# EAGLE design konekobit-001 (EAGLE 9.6.2)
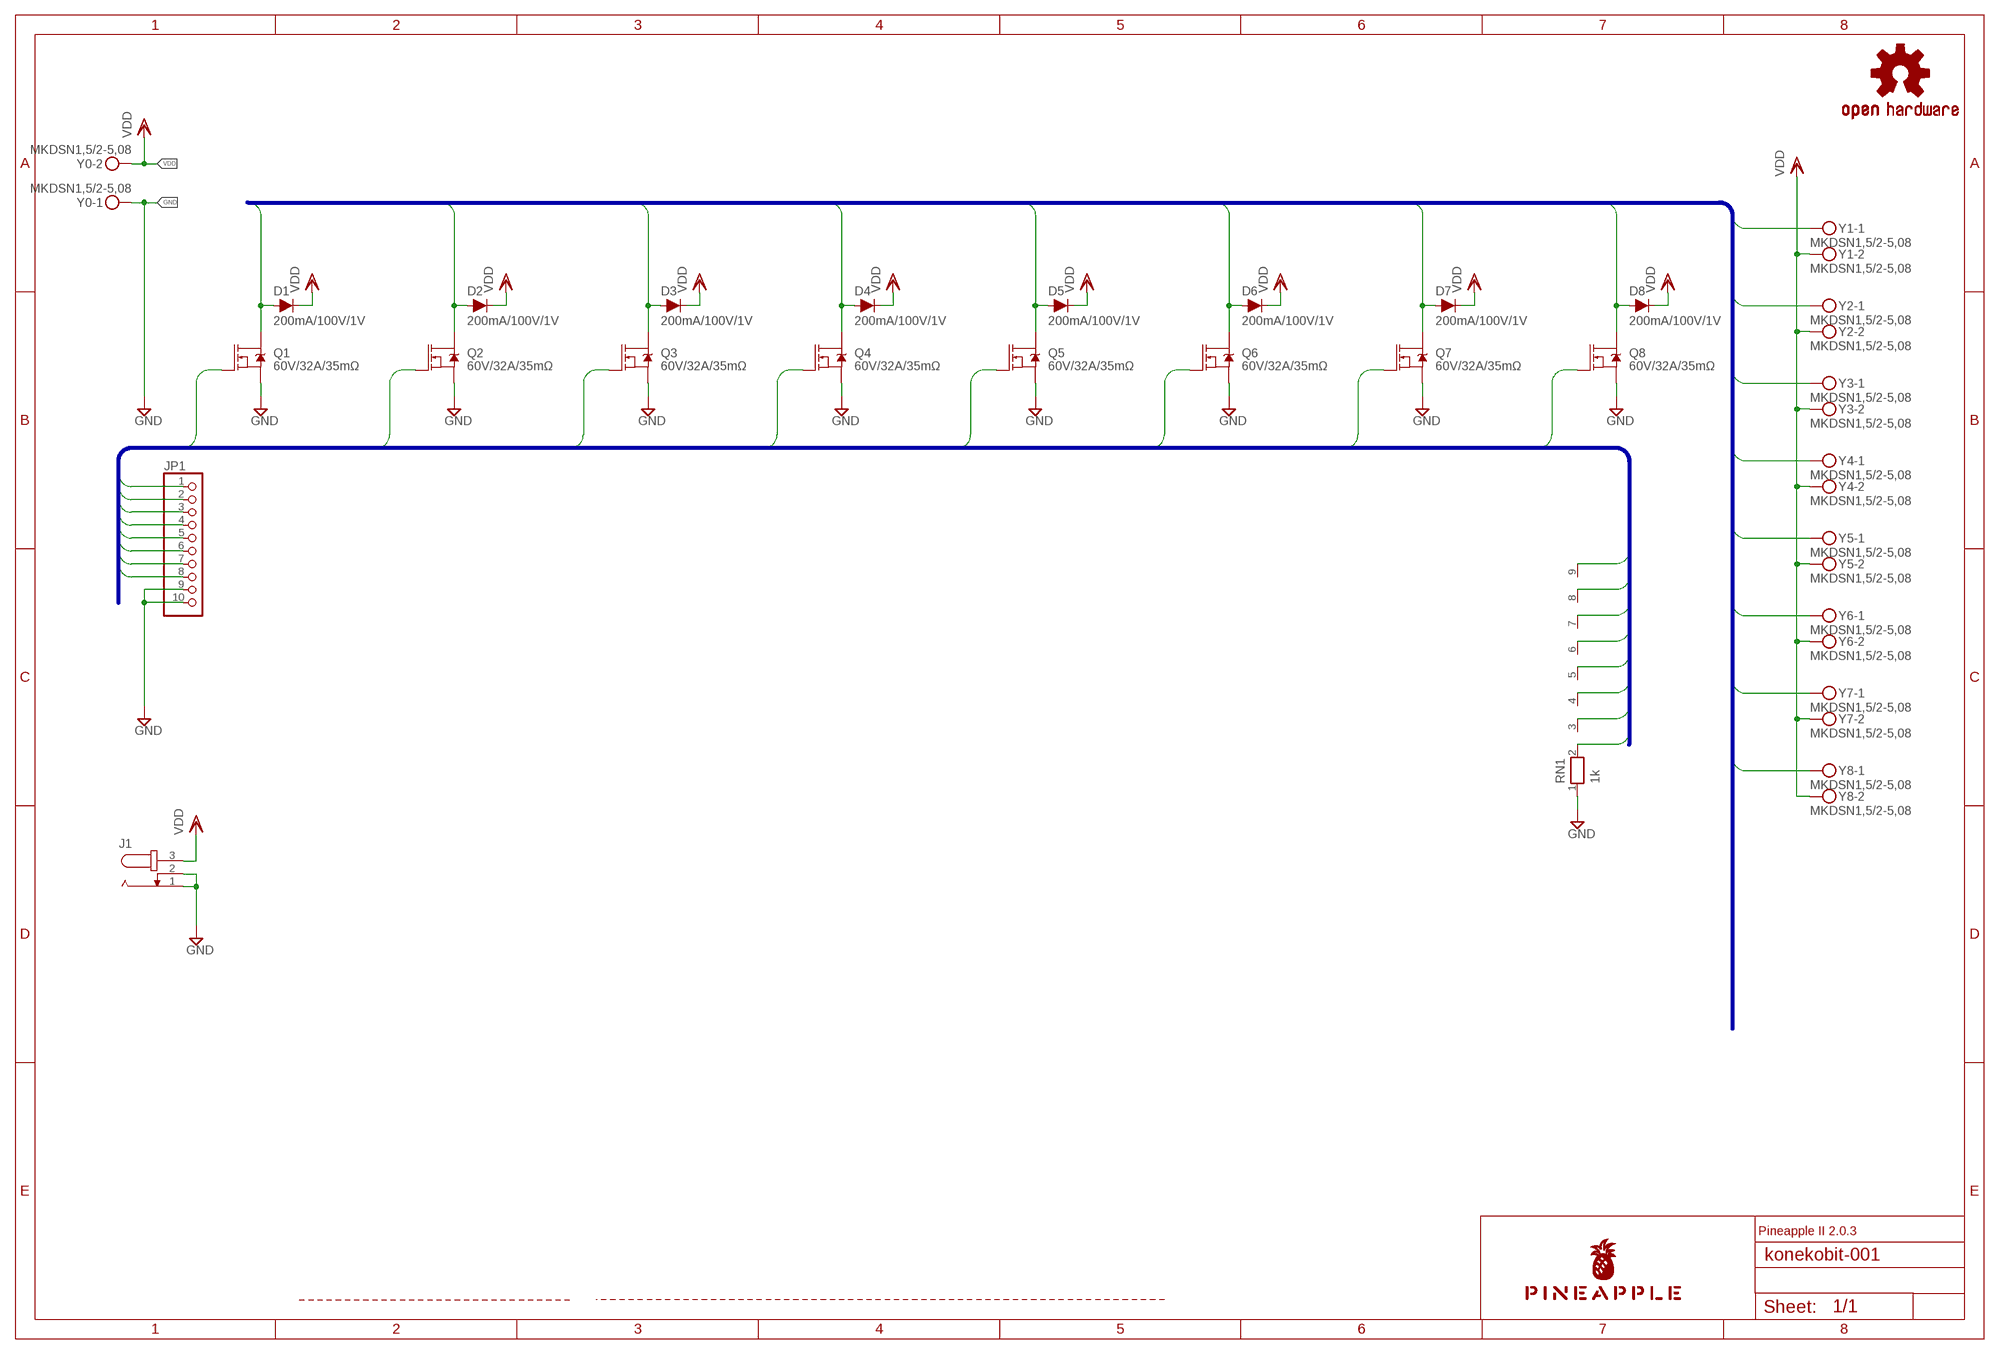
[diagram p0: schematic, sheet 1]

## Parts
D1  200mA/100V/1V  DIODE-1N4148  [DIODE-1N4148]
D2  200mA/100V/1V  DIODE-1N4148  [DIODE-1N4148]
D3  200mA/100V/1V  DIODE-1N4148  [DIODE-1N4148]
D4  200mA/100V/1V  DIODE-1N4148  [DIODE-1N4148]
D5  200mA/100V/1V  DIODE-1N4148  [DIODE-1N4148]
D6  200mA/100V/1V  DIODE-1N4148  [DIODE-1N4148]
D7  200mA/100V/1V  DIODE-1N4148  [DIODE-1N4148]
D8  200mA/100V/1V  DIODE-1N4148  [DIODE-1N4148]
J1  JACK-PLUG0  [SPC4077]
JP1  PINHD-1X10  [1X10]
LOGO1  OSHW-LOGOS-COPPER  [OSHW-LOGO-S_COPPER]
Q1  60V/32A/35mΩ  MOSFET-NCH-FQP30N06L  [TO220V]
Q2  60V/32A/35mΩ  MOSFET-NCH-FQP30N06L  [TO220V]
Q3  60V/32A/35mΩ  MOSFET-NCH-FQP30N06L  [TO220V]
Q4  60V/32A/35mΩ  MOSFET-NCH-FQP30N06L  [TO220V]
Q5  60V/32A/35mΩ  MOSFET-NCH-FQP30N06L  [TO220V]
Q6  60V/32A/35mΩ  MOSFET-NCH-FQP30N06L  [TO220V]
Q7  60V/32A/35mΩ  MOSFET-NCH-FQP30N06L  [TO220V]
Q8  60V/32A/35mΩ  MOSFET-NCH-FQP30N06L  [TO220V]
RN1  1k  RN08  [RN-9]
U$1  PINEAPPLE450_SILK  [PINEAPPLE450_SILK]
Y0  MKDSN1,5/2-5,08  [MKDSN1,5/2-5,08]
Y1  MKDSN1,5/2-5,08  [MKDSN1,5/2-5,08]
Y2  MKDSN1,5/2-5,08  [MKDSN1,5/2-5,08]
Y3  MKDSN1,5/2-5,08  [MKDSN1,5/2-5,08]
Y4  MKDSN1,5/2-5,08  [MKDSN1,5/2-5,08]
Y5  MKDSN1,5/2-5,08  [MKDSN1,5/2-5,08]
Y6  MKDSN1,5/2-5,08  [MKDSN1,5/2-5,08]
Y7  MKDSN1,5/2-5,08  [MKDSN1,5/2-5,08]
Y8  MKDSN1,5/2-5,08  [MKDSN1,5/2-5,08]

## Nets
DRAIN1 [power]: D1.A Q1.2(D) Y1.1
DRAIN2 [power]: D2.A Q2.2(D) Y2.1
DRAIN3 [power]: D3.A Q3.2(D) Y3.1
DRAIN4 [power]: D4.A Q4.2(D) Y4.1
DRAIN5 [power]: D5.A Q5.2(D) Y5.1
DRAIN6 [power]: D6.A Q6.2(D) Y6.1
DRAIN7 [power]: D7.A Q7.2(D) Y7.1
DRAIN8 [power]: D8.A Q8.2(D) Y8.1
GND [gnd]: J1.1 J1.2 JP1.9 JP1.10 Q1.3(S) Q2.3(S) Q3.3(S) Q4.3(S) Q5.3(S) Q6.3(S) Q7.3(S) Q8.3(S) RN1.1 Y0.1
PWM1: JP1.1 Q1.1(G) RN1.2
PWM2: JP1.2 Q2.1(G) RN1.3
PWM3: JP1.3 Q3.1(G) RN1.4
PWM4: JP1.4 Q4.1(G) RN1.5
PWM5: JP1.5 Q5.1(G) RN1.6
PWM6: JP1.6 Q6.1(G) RN1.7
PWM7: JP1.7 Q7.1(G) RN1.8
PWM8: JP1.8 Q8.1(G) RN1.9
VDD [superpower]: D1.C D2.C D3.C D4.C D5.C D6.C D7.C D8.C J1.3 Y0.2 Y1.2 Y2.2 Y3.2 Y4.2 Y5.2 Y6.2 Y7.2 Y8.2

## Buses
DRAIN1,DRAIN2,DRAIN3,DRAIN4,DRAIN5,DRAIN6,DRAIN7,DRAIN8
PWM1,PWM2,PWM3,PWM4,PWM5,PWM6,PWM7,PWM8

## Notes on the sheet
- Pineapple II 2.0.3

## Library data of the parts
D1-D8 = SparkFun-DiscreteSemi:DIODE: Diode These are standard reverse protection diodes and small signal diodes. SparkFun Products: SparkFun SparkPunk Sound Kit <https://www.sparkfun.com/products/11177> SparkFun ESP8266 Thing <https://www.sparkfun.com/products/13231>; PROD_ID: DIO-08378
J1 = con-jack:JACK-PLUG: DC POWER JACK Power Jack, DC, Right Angle, Through Hole, Rated 5A at 16VDC, PC Terminals Distributor: Farnell (www.Farnell.de) Drawing: 84N1161.pdf / 84N1162.pdf Manufacturer: SPC Technology (www.spctechnology.com) Type: SPC4077 / SPC 4078; OC_FARNELL: unknown; OC_NEWARK: unknown
JP1 = pinhead:PINHD-1X10: PIN HEADER
LOGO1 = SparkFun-Aesthetics:OSHW-LOGO: Open-Source Hardware (OSHW) Logo This logo indicates the piece of hardware it is found on incorporates a OSHW license and/or adheres to the definition of open source hardware found here: http://freedomdefined.org/OSHW
Q1-Q8 = SparkFun-DiscreteSemi:MOSFET-NCH: N-channel MOSFETs Voltage controlled devices that allow control of high current outputs. SparkFun Products: SparkFun OpenScale <https://www.sparkfun.com/products/13261> SparkFun Digital Sandbox <https://www.sparkfun.com/products/12651> SparkFun Monster Moto Shield <https://www.sparkfun.com/products/10182> SparkFun MOSFET Power Controller <https://www.sparkfun.com/products/11214>; PROD_ID: TRANS-10060
RN1 = resistor-net:RN08: RESISTOR NETWORK; OC_FARNELL: unknown; OC_NEWARK: unknown
U$1 = pineapple:PINEAPPLE450_SILK
Y0 Y1-Y8 = con-phoenix-508:MKDSN1,5/2-5,08: MKDSN 1,5/ 2-5,08 Printklemme Nennstrom: 13,5 A Nennspannung: 250 V Rastermaß: 5,08 mm Polzahl: 2 Anschlussart: Schraubanschluss Montage: Löten Anschlussrichtung Leiter/Platine: 0 ° Artikelnummer: 1729128 Source: http://eshop.phoenixcontact.com .. 1729128.pdf

## Net classes
0 default: width 0.152 mm, drill 0.152 mm, clearance 0.152 mm
1 gnd: width 2.032 mm, drill 0.152 mm, clearance 0.152 mm
2 power: width 1.016 mm, drill 0.152 mm, clearance 0.152 mm
3 analog: width 0.305 mm, drill 0.152 mm, clearance 0.152 mm
4 superpower: width 2.032 mm, drill 0.152 mm, clearance 0.152 mm

## Board
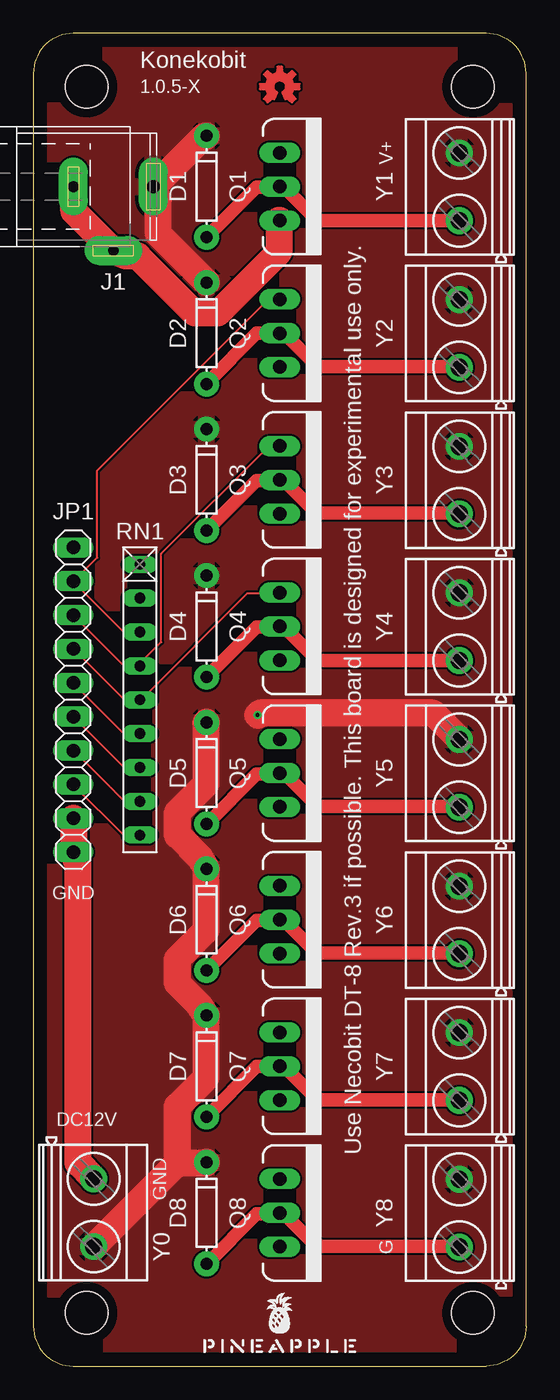
[diagram p1: board, top side]
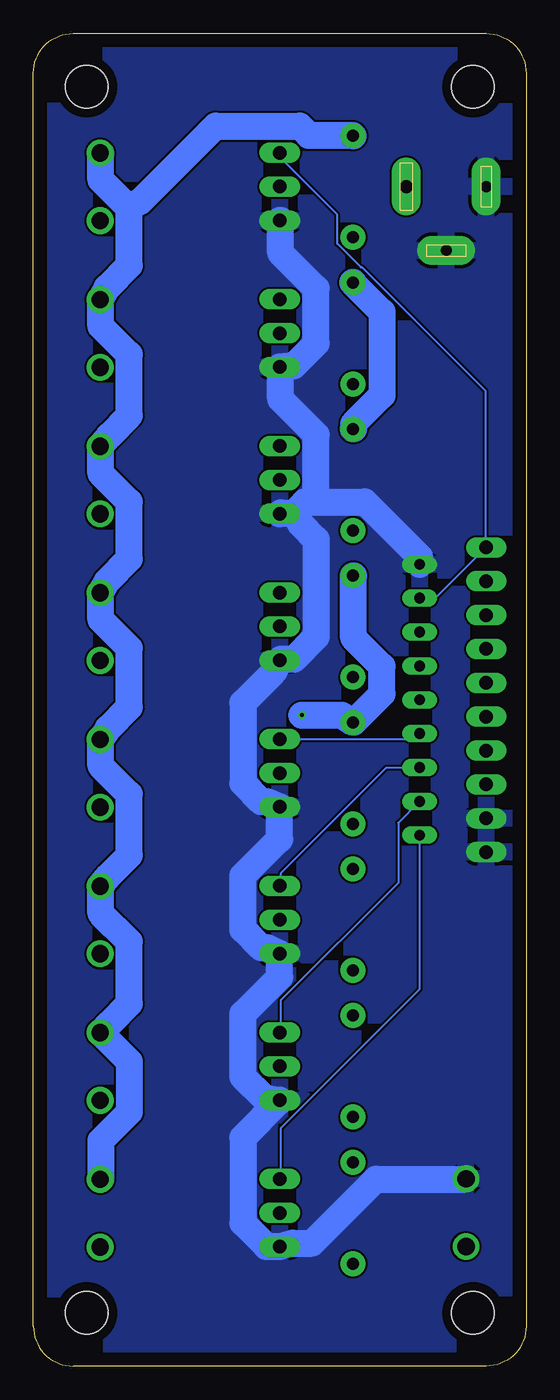
[diagram p2: board, bottom side, seen from below]

Size 37 x 100 mm. Coordinates in mm from the lower left corner, seen from the top.
Outline: 3,0 34,0 arc90 37,3 37,97 arc90 34,100 3,100 arc90 0,97 0,3 arc90 3,0
Copper layers (1*16): Top 0.035mm / dielectric 1.5mm / Bottom 0.035mm
Design rules "SeeedStudio_2layer_DRU_no_angle_20140221": minimum track width 6mil, minimum drill 12mil, track to track 6mil, track to pad 6mil, pad to pad 6mil, via to via 6mil, smd to smd 0mil, copper to edge 10mil, drill to drill 10mil, minimum pad ring 10mil, minimum via ring 6mil, stop-mask expansion 2mil, vias tented up to drill 100mil, thermal gap 10mil
Holes 3.2 mm at 4,4 4,96 33,96 33,4
tRestrict: area 1.8,93.8 to 6.2,98.2; area 1.8,1.8 to 6.2,6.2; area 30.8,93.8 to 35.2,98.2; area 30.8,1.8 to 35.2,6.2; area 0,99 to 37,100; area 0,0 to 37,1; area 0,0 to 1,100; area 36,0 to 37,100
bRestrict: area 1.8,1.8 to 6.2,6.2; area 1.8,93.8 to 6.2,98.2; area 30.8,93.8 to 35.2,98.2; area 30.8,1.8 to 35.2,6.2; area 0,99 to 37,100; area 0,0 to 37,1; area 0,0 to 1,100; area 36,0 to 37,100

### Footprints (pad centres in the part's own frame; a part is rotated, then mirrored left to right if it is on the bottom)
DIODE-1N4148 = drill 0.9 pad 1.88: A -3.81,0; C 3.81,0
SPC4077 = drill 0.8 pad 2.184 long: 1 -3,0; 2 0,-4.8 | drill 1 pad 2.184 long: 3 3,0
1X10 = drill 1.016 long: 1 -11.43,0; 2 -8.89,0; 3 -6.35,0; 4 -3.81,0; 5 -1.27,0; 6 1.27,0; 7 3.81,0; 8 6.35,0; 9 8.89,0; 10 11.43,0
TO220V = drill 1.016 long: 1 -2.54,0; 2 0,0; 3 2.54,0
RN-9 = drill 0.813 long: 1 -10.16,0; 2 -7.62,0; 3 -5.08,0; 4 -2.54,0; 5 0,0; 6 2.54,0; 7 5.08,0; 8 7.62,0; 9 10.16,0
MKDSN1,5/2-5,08 = drill 1.3 pad 2: 1 -2.561,0.025; 2 2.519,0.025

### Placement (x,y rotation side)
D1  13,88.5 90 top
D2  13,77.5 90 top
D3  13,66.5 90 top
D4  13,55.5 90 top
D5  13,44.5 90 top
D6  13,33.5 90 top
D7  13,22.5 90 top
D8  13,11.5 90 top
J1  6,88.5 0 top
JP1  3,50 270 top
LOGO1  18.5,96 0 top
Q1  18.5,88.5 270 top
Q2  18.5,77.5 270 top
Q3  18.5,66.5 270 top
Q4  18.5,55.5 270 top
Q5  18.5,44.5 270 top
Q6  18.5,33.5 270 top
Q7  18.5,22.5 270 top
Q8  18.5,11.5 270 top
RN1  8,50 270 top
U$1  18.5,1 0 top
Y0  4.5,11.5 270 top
Y1  32,88.5 90 top
Y2  32,77.5 90 top
Y3  32,66.5 90 top
Y4  32,55.5 90 top
Y5  32,44.5 90 top
Y6  32,33.5 90 top
Y7  32,22.5 90 top
Y8  32,11.5 90 top

### Tracks (layer width: path | path; a pad name or v marks a point on that pad's centre or on a via)
DRAIN1
  Top 1.016: D1.A 13.03,84.73 16.76,88.47 18.44,88.47 Q1.2 18.97,88.32 21.34,85.95 31.93,85.95 Y1.1
DRAIN2
  Top 1.016: D2.A 13.03,73.76 16.76,77.5 18.44,77.5 Q2.2 18.97,77.34 21.34,74.98 31.93,74.98 Y2.1
DRAIN3
  Top 1.016: D3.A 13.03,62.71 16.76,66.45 18.44,66.45 Q3.2 18.97,66.29 21.26,64.01 31.93,64.01 Y3.1
DRAIN4
  Top 1.016: D4.A 13.03,51.74 16.76,55.47 18.44,55.47 Q4.2 18.97,55.32 21.34,52.96 31.93,52.96 Y4.1
DRAIN5
  Top 1.016: D5.A 13.03,40.69 16.76,44.42 18.44,44.42 Q5.2 18.97,44.35 21.34,41.99 31.93,41.99 Y5.1
DRAIN6
  Top 1.016: D6.A 13.03,29.72 16.76,33.45 18.44,33.45 Q6.2 18.97,33.3 21.26,31.01 31.93,31.01 Y6.1
DRAIN7
  Top 1.016: D7.A 13.03,18.75 16.76,22.48 18.44,22.48 Q7.2 18.97,22.33 21.34,19.96 31.93,19.96 Y7.1
DRAIN8
  Top 1.016: D8.A 13.03,7.7 16.76,11.43 18.44,11.43 Q8.2 18.97,11.28 21.26,8.99 31.93,8.99 Y8.1
GND
  Top 2.032: JP1.9 3.05,41.07 3.05,38.63 JP1.10 3.35,37.64 3.35,15.24 4.5,14.1 Y0.1 | J1.1 3.05,88.47 3.05,86.64 5.94,83.74 J1.2 6.93,83.29 7.85,83.29 12.12,79.02 13.87,79.02 18.44,83.59 18.44,85.95 Q1.3
  Bottom 2.032: Y0.1 4.57,14.02 11.28,14.02 16.08,9.22 17.53,9.22 Q8.3 18.52,8.99 19.51,8.99 21.26,10.74 21.26,17.14 18.52,19.89 Q7.3 19.66,20.12 21.26,21.72 21.26,26.44 18.52,29.18 18.52,30.94 Q6.3 19.43,31.39 19.89,31.39 21.26,32.77 21.26,36.8 18.52,39.55 18.52,41.91 Q5.3 19.43,42.37 19.89,42.37 21.26,43.74 21.26,49.76 18.97,52.05 Q4.3 18.44,53.03 17.45,53.03 15.77,54.71 15.77,62.03 16.92,63.17 17.45,64.01 | 15.77,64.85 16.61,64.85 17.45,64.01 | 15.77,64.85 12.12,64.85 8,60.73 8,60.2 RN1.1 | 17.45,64.01 18.44,64.01 Q3.3 | 15.77,64.85 15.77,69.88 18.44,72.54 18.44,74.91 Q2.3 17.45,75.06 15.77,76.73 15.77,80.85 18.44,83.52 18.44,85.95 Q1.3
  pour Bottom: -2,-2 40,-2 40,102 -2,102
PWM1
  Bottom 0.152: RN1.2 7.92,57.68 6.78,57.68 3.05,61.42 JP1.1 3.05,61.49 3.05,73.15 12.34,82.45 12.42,82.45 14.17,84.2 14.17,86.41 18.44,90.68 18.44,90.98 Q1.1
PWM2
  Top 0.152: RN1.3 7.92,55.09 6.78,55.09 3.05,58.83 JP1.2 3.05,58.9 4.8,60.66 4.8,67.21 17.6,80.01 18.44,80.01 Q2.1
PWM3
  Top 0.152: JP1.3 3.05,56.31 6.78,52.58 7.92,52.58 RN1.4 7.92,52.65 9.6,54.33 9.6,60.96 17.68,69.04 18.44,69.04 Q3.1
PWM4
  Top 0.152: JP1.4 3.05,53.8 6.78,50.06 7.92,50.06 RN1.5 8.08,49.99 16.08,57.99 18.44,57.99 Q4.1
PWM5
  Top 0.152: RN1.6 7.92,47.47 6.78,47.47 3.05,51.21 JP1.5
  Bottom 0.152: Q5.1 18.44,47.02 8.38,47.02 8,47.4 RN1.6
PWM6
  Top 0.152: RN1.7 7.92,44.96 6.78,44.96 3.05,48.69 JP1.6
  Bottom 0.152: Q6.1 18.44,36.04 18.44,36.96 10.52,44.88 8,44.88 RN1.7
PWM7
  Top 0.152: RN1.8 7.92,42.44 6.78,42.44 3.05,46.18 JP1.7
  Bottom 0.152: Q7.1 18.44,25.07 18.44,27.43 9.6,36.27 9.6,40.77 8,42.37 RN1.8
PWM8
  Top 0.152: RN1.9 7.92,39.85 6.78,39.85 3.05,43.59 JP1.8
  Bottom 0.152: Q8.1 18.44,14.1 18.44,17.83 8,28.27 8,39.78 RN1.9
VDD  (via drill 0.3)
  Top 2.032: 10.82,15.24 12.95,15.24 D8.C | 10.82,15.24 4.57,8.99 Y0.2 | 12.95,26.29 12.95,21.64 10.82,19.51 10.82,15.24 | 12.95,26.29 D7.C | 12.95,26.29 12.42,27.13 10.82,28.73 10.82,30.56 12.95,32.69 12.95,37.26 D6.C 12.5,38.18 10.82,39.85 10.82,41.53 12.95,43.66 12.95,48.23 D5.C | D1.C 12.95,92.28 12.8,92.28 9.07,88.54 J1.3 9.37,87.55 9.37,84.96 12.95,81.38 D2.C | v16.84,48.84 16.99,49 30.02,49 31.93,47.09 Y5.2
  Bottom 2.032: D4.C 12.95,59.28 12.95,54.63 10.82,52.5 10.82,50.44 12.95,48.31 D5.C 13.87,48.84 v16.84,48.84 | D3.C 12.95,70.33 12.95,70.71 10.82,72.85 10.82,79.1 13.03,81.31 D2.C | 31.93,24.99 29.79,22.86 29.79,19.05 31.93,16.92 31.93,14.02 Y8.2 | 31.93,24.99 Y7.2 | 31.93,24.99 31.24,25.76 29.79,27.2 29.79,31.85 31.93,33.98 31.93,35.97 Y6.2 31.32,36.8 29.79,38.33 29.79,42.9 31.93,45.03 31.93,47.02 | 31.93,47.02 Y5.2 | 31.93,47.02 31.39,47.85 29.79,49.45 29.79,53.87 31.93,56.01 31.93,57.99 Y4.2 31.47,58.9 29.79,60.58 29.79,64.85 31.93,66.98 31.93,68.96 Y3.2 31.32,69.8 29.79,71.32 29.79,75.89 31.93,78.03 31.93,80.01 Y2.2 31.47,80.92 29.79,82.6 29.79,86.87 | 29.79,86.87 31.93,89 31.93,90.98 Y1.2 | D1.C 13.03,92.35 16.31,92.35 16.99,93.04 23.32,93.04 28.96,87.4 29.79,86.87
  pour Top: -1,-1 38,-1 38,101 -1,101

### Text on the board
tNames: Konekobit | 1.0.5-X | V+ | Use Necobit DT-8 Rev.3 if possible. This board is designed for experimental use only. | GND | DC12V | GND | G